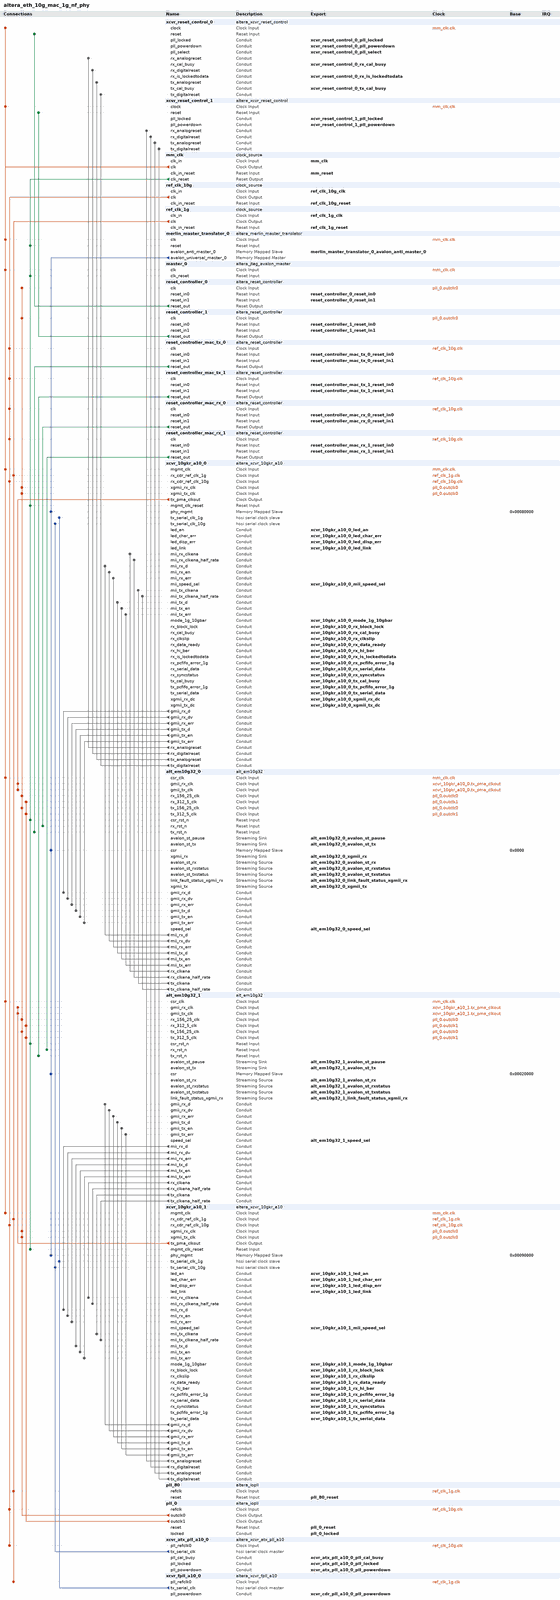
[diagram p0: system contents, whole]
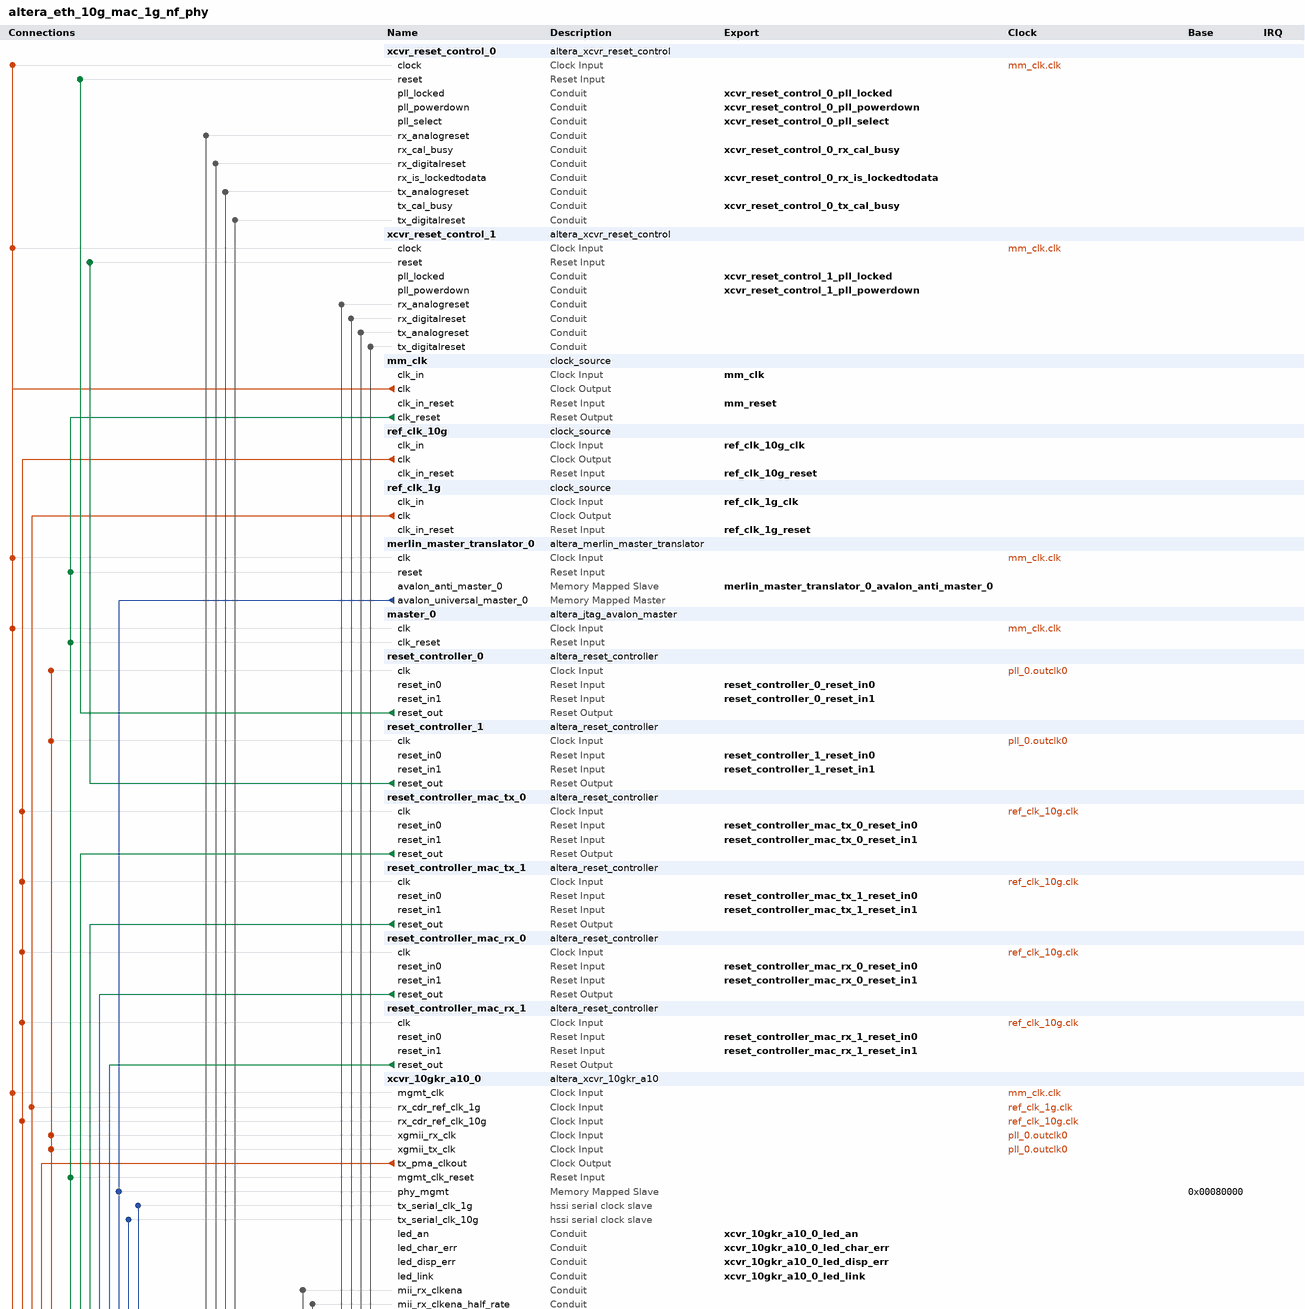
[diagram p1: system contents, upper part]
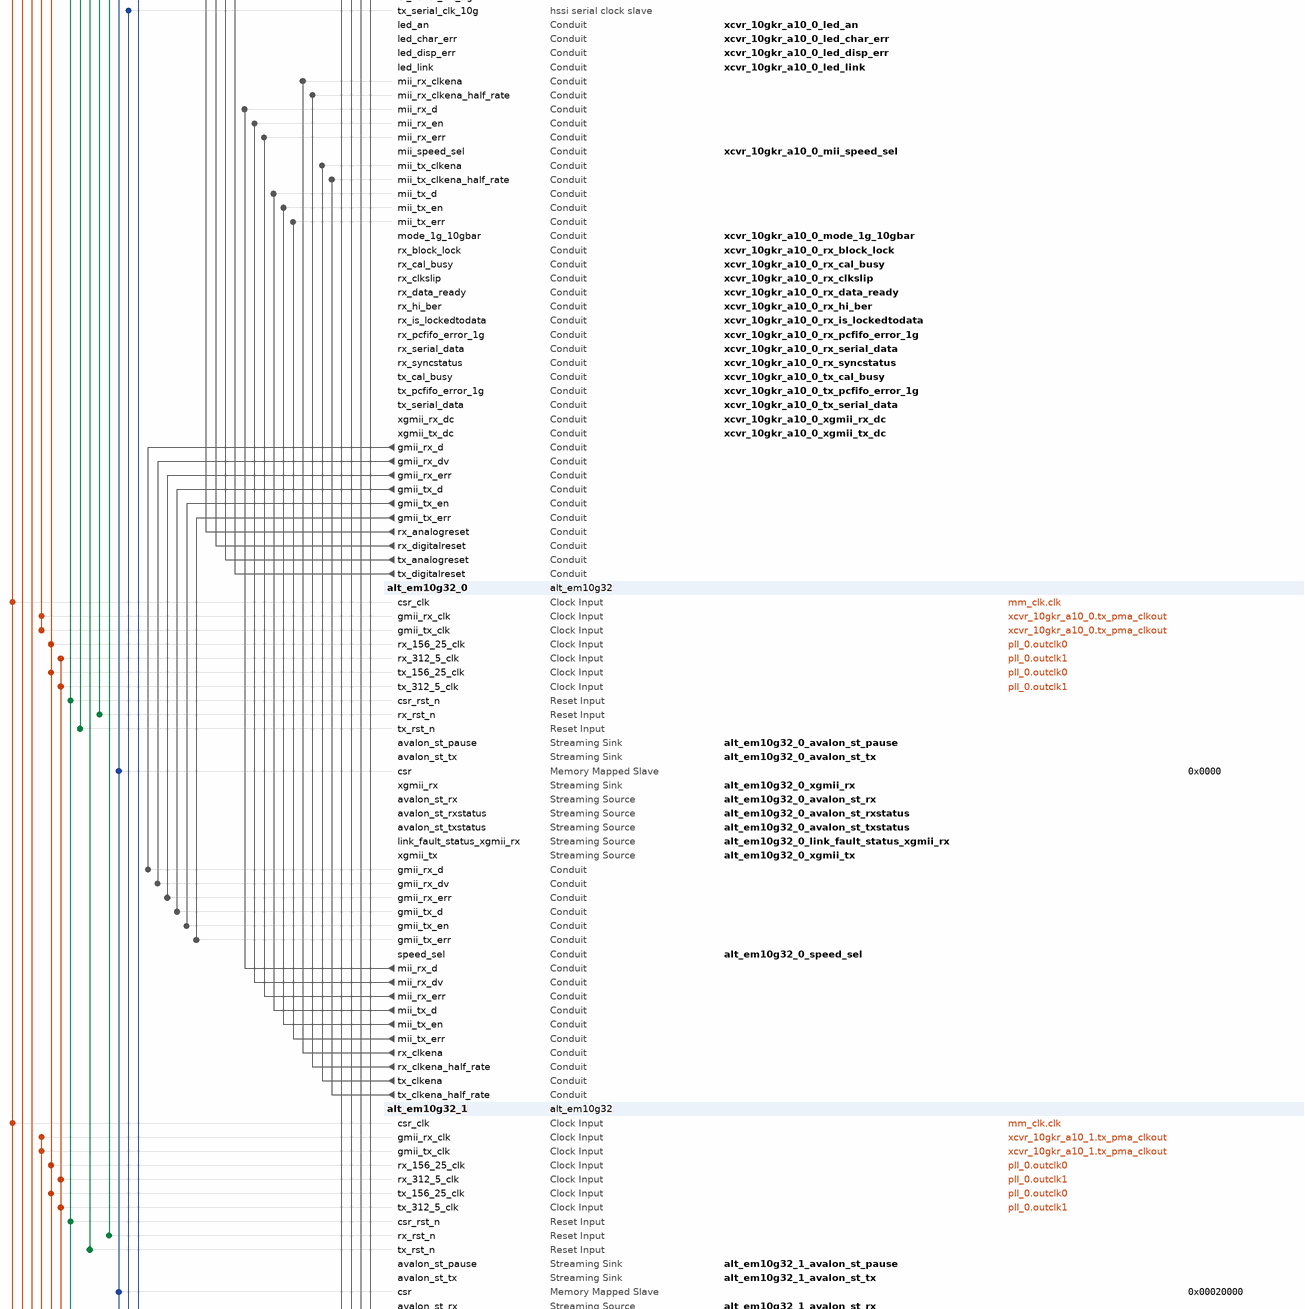
[diagram p2: system contents, middle part]
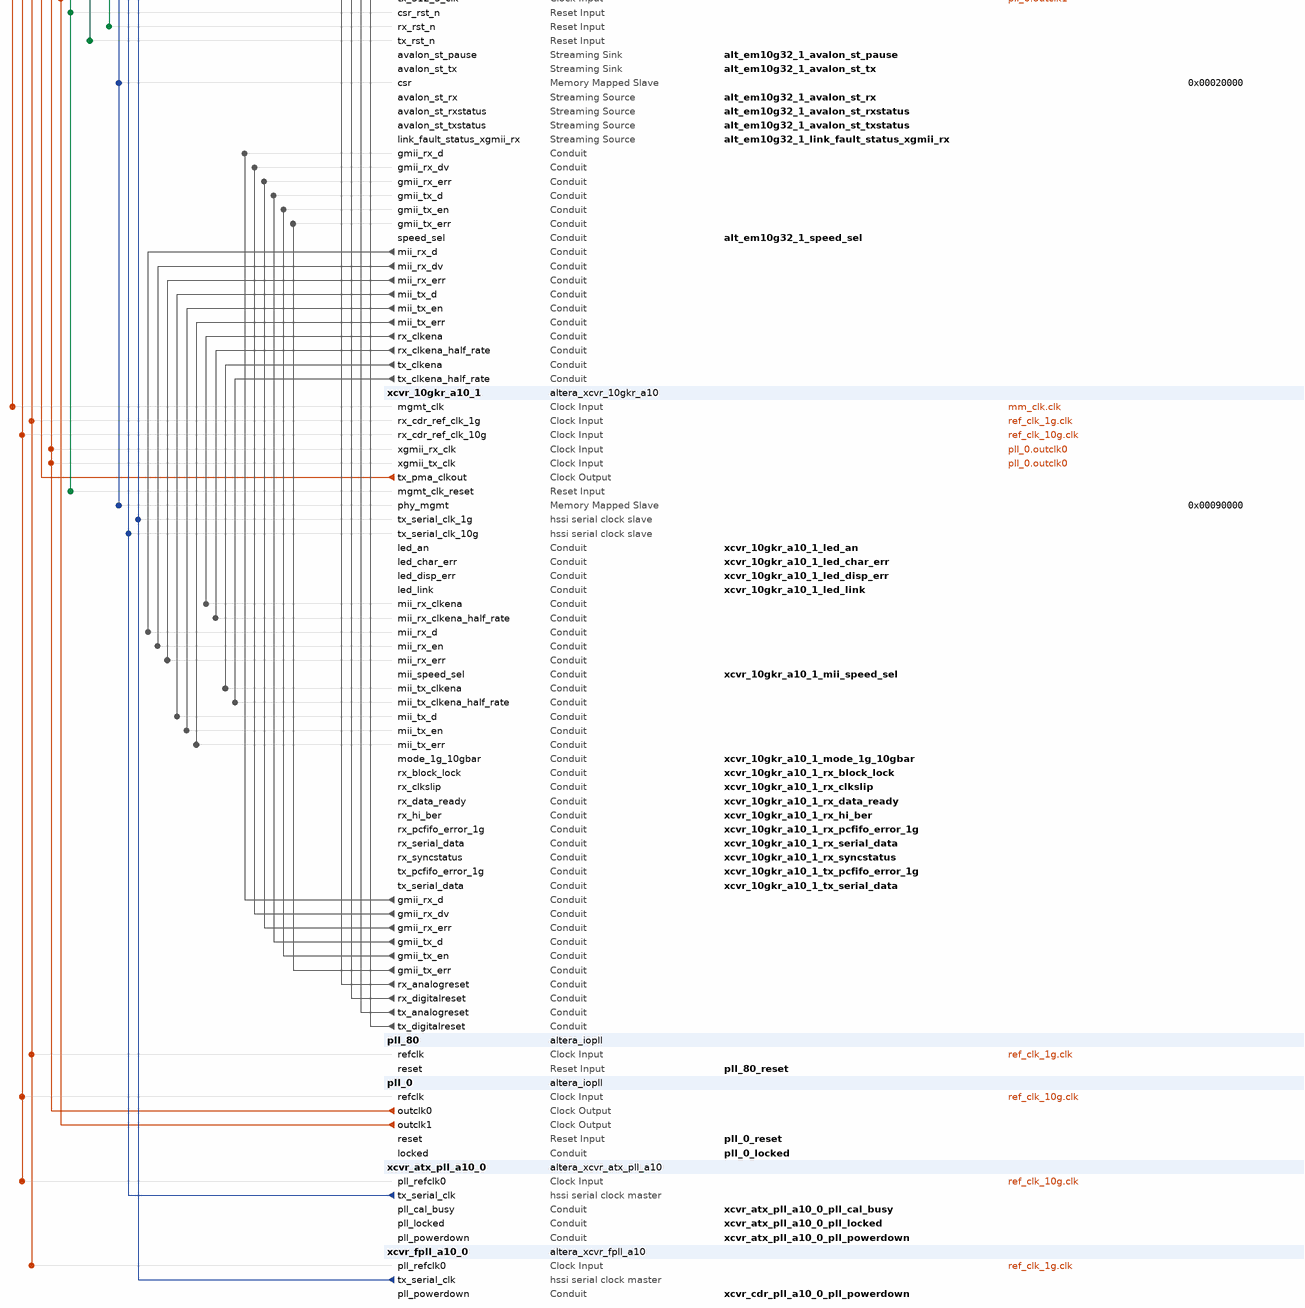
[diagram p3: system contents, lower part]
# Platform Designer (Qsys) system altera_eth_10g_mac_1g_nf_phy, Arria 10 10AX115S4F45I3SG
# Parameters at their usual value, and those the tool derives, are not listed.
package require -exact qsys 1.0
create_system altera_eth_10g_mac_1g_nf_phy
set_project_property DEVICE_FAMILY {Arria 10}
set_project_property DEVICE 10AX115S4F45I3SG

add_component xcvr_reset_control_0 ip/altera_eth_10g_mac_1g_nf_phy/altera_eth_10g_mac_1g_nf_phy_xcvr_reset_control_0.ip altera_xcvr_reset_control xcvr_reset_control_0 18.0

add_component xcvr_reset_control_1 ip/altera_eth_10g_mac_1g_nf_phy/altera_eth_10g_mac_1g_nf_phy_xcvr_reset_control_1.ip altera_xcvr_reset_control xcvr_reset_control_1 18.0

add_component mm_clk ip/altera_eth_10g_mac_1g_nf_phy/altera_eth_10g_mac_1g_nf_phy_mm_clk.ip clock_source mm_clk 

add_component ref_clk_10g ip/altera_eth_10g_mac_1g_nf_phy/altera_eth_10g_mac_1g_nf_phy_ref_clk_10g.ip clock_source ref_clk_10g 

add_component ref_clk_1g ip/altera_eth_10g_mac_1g_nf_phy/altera_eth_10g_mac_1g_nf_phy_ref_clk_1g.ip clock_source ref_clk_1g 

add_component merlin_master_translator_0 ip/altera_eth_10g_mac_1g_nf_phy/altera_eth_10g_mac_1g_nf_phy_merlin_master_translator_0.ip altera_merlin_master_translator merlin_master_translator_0 18.0

add_component master_0 ip/altera_eth_10g_mac_1g_nf_phy/altera_eth_10g_mac_1g_nf_phy_master_0.ip altera_jtag_avalon_master master_0 18.0

add_component reset_controller_0 ip/altera_eth_10g_mac_1g_nf_phy/altera_eth_10g_mac_1g_nf_phy_reset_controller_0.ip altera_reset_controller reset_controller_0 18.0

add_component reset_controller_1 ip/altera_eth_10g_mac_1g_nf_phy/altera_eth_10g_mac_1g_nf_phy_reset_controller_1.ip altera_reset_controller reset_controller_1 18.0

add_component reset_controller_mac_tx_0 ip/altera_eth_10g_mac_1g_nf_phy/altera_eth_10g_mac_1g_nf_phy_reset_controller_mac_tx_0.ip altera_reset_controller reset_controller_mac_tx_0 18.0

add_component reset_controller_mac_tx_1 ip/altera_eth_10g_mac_1g_nf_phy/altera_eth_10g_mac_1g_nf_phy_reset_controller_mac_tx_1.ip altera_reset_controller reset_controller_mac_tx_1 18.0

add_component reset_controller_mac_rx_0 ip/altera_eth_10g_mac_1g_nf_phy/altera_eth_10g_mac_1g_nf_phy_reset_controller_mac_rx_0.ip altera_reset_controller reset_controller_mac_rx_0 18.0

add_component reset_controller_mac_rx_1 ip/altera_eth_10g_mac_1g_nf_phy/altera_eth_10g_mac_1g_nf_phy_reset_controller_mac_rx_1.ip altera_reset_controller reset_controller_mac_rx_1 18.0

add_component xcvr_10gkr_a10_0 ip/altera_eth_10g_mac_1g_nf_phy/altera_eth_10g_mac_1g_nf_phy_xcvr_10gkr_a10_0.ip altera_xcvr_10gkr_a10 xcvr_10gkr_a10_0 18.0

add_component alt_em10g32_0 ip/altera_eth_10g_mac_1g_nf_phy/altera_eth_10g_mac_1g_nf_phy_alt_em10g32_0.ip alt_em10g32 alt_em10g32_0 18.0

add_component alt_em10g32_1 ip/altera_eth_10g_mac_1g_nf_phy/altera_eth_10g_mac_1g_nf_phy_alt_em10g32_1.ip alt_em10g32 alt_em10g32_1 18.0

add_component xcvr_10gkr_a10_1 ip/altera_eth_10g_mac_1g_nf_phy/altera_eth_10g_mac_1g_nf_phy_xcvr_10gkr_a10_1.ip altera_xcvr_10gkr_a10 xcvr_10gkr_a10_1 18.0

add_component pll_80 ip/altera_eth_10g_mac_1g_nf_phy/altera_eth_10g_mac_1g_nf_phy_pll_80.ip altera_iopll pll_80 18.0

add_component pll_0 ip/altera_eth_10g_mac_1g_nf_phy/altera_eth_10g_mac_1g_nf_phy_pll_0.ip altera_iopll pll_0 18.0

add_component xcvr_atx_pll_a10_0 ip/altera_eth_10g_mac_1g_nf_phy/altera_eth_10g_mac_1g_nf_phy_xcvr_atx_pll_a10_0.ip altera_xcvr_atx_pll_a10 xcvr_atx_pll_a10_0 18.0

add_component xcvr_fpll_a10_0 ip/altera_eth_10g_mac_1g_nf_phy/altera_eth_10g_mac_1g_nf_phy_xcvr_fpll_a10_0.ip altera_xcvr_fpll_a10 xcvr_fpll_a10_0 18.0

# connections
add_connection mm_clk.clk alt_em10g32_0.csr_clk clock
add_connection mm_clk.clk alt_em10g32_1.csr_clk clock
add_connection mm_clk.clk master_0.clk clock
add_connection mm_clk.clk merlin_master_translator_0.clk clock
add_connection mm_clk.clk xcvr_10gkr_a10_0.mgmt_clk clock
add_connection mm_clk.clk xcvr_10gkr_a10_1.mgmt_clk clock
add_connection mm_clk.clk xcvr_reset_control_0.clock clock
add_connection mm_clk.clk xcvr_reset_control_1.clock clock
add_connection pll_0.outclk0 alt_em10g32_0.rx_156_25_clk clock
add_connection pll_0.outclk0 alt_em10g32_0.tx_156_25_clk clock
add_connection pll_0.outclk0 alt_em10g32_1.rx_156_25_clk clock
add_connection pll_0.outclk0 alt_em10g32_1.tx_156_25_clk clock
add_connection pll_0.outclk0 reset_controller_0.clk clock
add_connection pll_0.outclk0 reset_controller_1.clk clock
add_connection pll_0.outclk0 xcvr_10gkr_a10_0.xgmii_rx_clk clock
add_connection pll_0.outclk0 xcvr_10gkr_a10_0.xgmii_tx_clk clock
add_connection pll_0.outclk0 xcvr_10gkr_a10_1.xgmii_rx_clk clock
add_connection pll_0.outclk0 xcvr_10gkr_a10_1.xgmii_tx_clk clock
add_connection pll_0.outclk1 alt_em10g32_0.rx_312_5_clk clock
add_connection pll_0.outclk1 alt_em10g32_0.tx_312_5_clk clock
add_connection pll_0.outclk1 alt_em10g32_1.rx_312_5_clk clock
add_connection pll_0.outclk1 alt_em10g32_1.tx_312_5_clk clock
add_connection ref_clk_1g.clk pll_80.refclk clock
add_connection ref_clk_1g.clk xcvr_10gkr_a10_0.rx_cdr_ref_clk_1g clock
add_connection ref_clk_1g.clk xcvr_10gkr_a10_1.rx_cdr_ref_clk_1g clock
add_connection ref_clk_1g.clk xcvr_fpll_a10_0.pll_refclk0 clock
add_connection ref_clk_10g.clk pll_0.refclk clock
add_connection ref_clk_10g.clk reset_controller_mac_rx_0.clk clock
add_connection ref_clk_10g.clk reset_controller_mac_rx_1.clk clock
add_connection ref_clk_10g.clk reset_controller_mac_tx_0.clk clock
add_connection ref_clk_10g.clk reset_controller_mac_tx_1.clk clock
add_connection ref_clk_10g.clk xcvr_10gkr_a10_0.rx_cdr_ref_clk_10g clock
add_connection ref_clk_10g.clk xcvr_10gkr_a10_1.rx_cdr_ref_clk_10g clock
add_connection ref_clk_10g.clk xcvr_atx_pll_a10_0.pll_refclk0 clock
add_connection xcvr_10gkr_a10_0.tx_pma_clkout alt_em10g32_0.gmii_rx_clk clock
add_connection xcvr_10gkr_a10_0.tx_pma_clkout alt_em10g32_0.gmii_tx_clk clock
add_connection xcvr_10gkr_a10_1.tx_pma_clkout alt_em10g32_1.gmii_rx_clk clock
add_connection xcvr_10gkr_a10_1.tx_pma_clkout alt_em10g32_1.gmii_tx_clk clock
add_connection mm_clk.clk_reset alt_em10g32_0.csr_rst_n reset
add_connection mm_clk.clk_reset alt_em10g32_1.csr_rst_n reset
add_connection mm_clk.clk_reset master_0.clk_reset reset
add_connection mm_clk.clk_reset merlin_master_translator_0.reset reset
add_connection mm_clk.clk_reset xcvr_10gkr_a10_0.mgmt_clk_reset reset
add_connection mm_clk.clk_reset xcvr_10gkr_a10_1.mgmt_clk_reset reset
add_connection reset_controller_0.reset_out xcvr_reset_control_0.reset reset
add_connection reset_controller_1.reset_out xcvr_reset_control_1.reset reset
add_connection reset_controller_mac_rx_0.reset_out alt_em10g32_0.rx_rst_n reset
add_connection reset_controller_mac_rx_1.reset_out alt_em10g32_1.rx_rst_n reset
add_connection reset_controller_mac_tx_0.reset_out alt_em10g32_0.tx_rst_n reset
add_connection reset_controller_mac_tx_1.reset_out alt_em10g32_1.tx_rst_n reset
add_connection merlin_master_translator_0.avalon_universal_master_0 alt_em10g32_0.csr avalon
set_connection_parameter_value merlin_master_translator_0.avalon_universal_master_0/alt_em10g32_0.csr baseAddress 0x0000
add_connection merlin_master_translator_0.avalon_universal_master_0 alt_em10g32_1.csr avalon
set_connection_parameter_value merlin_master_translator_0.avalon_universal_master_0/alt_em10g32_1.csr baseAddress 0x00020000
add_connection merlin_master_translator_0.avalon_universal_master_0 xcvr_10gkr_a10_0.phy_mgmt avalon
set_connection_parameter_value merlin_master_translator_0.avalon_universal_master_0/xcvr_10gkr_a10_0.phy_mgmt baseAddress 0x00080000
add_connection merlin_master_translator_0.avalon_universal_master_0 xcvr_10gkr_a10_1.phy_mgmt avalon
set_connection_parameter_value merlin_master_translator_0.avalon_universal_master_0/xcvr_10gkr_a10_1.phy_mgmt baseAddress 0x00090000
add_connection alt_em10g32_0.mii_rx_d xcvr_10gkr_a10_0.mii_rx_d conduit
add_connection alt_em10g32_0.mii_rx_dv xcvr_10gkr_a10_0.mii_rx_en conduit
add_connection alt_em10g32_0.mii_rx_err xcvr_10gkr_a10_0.mii_rx_err conduit
add_connection alt_em10g32_0.mii_tx_d xcvr_10gkr_a10_0.mii_tx_d conduit
add_connection alt_em10g32_0.mii_tx_en xcvr_10gkr_a10_0.mii_tx_en conduit
add_connection alt_em10g32_0.mii_tx_err xcvr_10gkr_a10_0.mii_tx_err conduit
add_connection alt_em10g32_0.rx_clkena xcvr_10gkr_a10_0.mii_rx_clkena conduit
add_connection alt_em10g32_0.rx_clkena_half_rate xcvr_10gkr_a10_0.mii_rx_clkena_half_rate conduit
add_connection alt_em10g32_0.tx_clkena xcvr_10gkr_a10_0.mii_tx_clkena conduit
add_connection alt_em10g32_0.tx_clkena_half_rate xcvr_10gkr_a10_0.mii_tx_clkena_half_rate conduit
add_connection alt_em10g32_1.mii_rx_d xcvr_10gkr_a10_1.mii_rx_d conduit
add_connection alt_em10g32_1.mii_rx_dv xcvr_10gkr_a10_1.mii_rx_en conduit
add_connection alt_em10g32_1.mii_rx_err xcvr_10gkr_a10_1.mii_rx_err conduit
add_connection alt_em10g32_1.mii_tx_d xcvr_10gkr_a10_1.mii_tx_d conduit
add_connection alt_em10g32_1.mii_tx_en xcvr_10gkr_a10_1.mii_tx_en conduit
add_connection alt_em10g32_1.mii_tx_err xcvr_10gkr_a10_1.mii_tx_err conduit
add_connection alt_em10g32_1.rx_clkena xcvr_10gkr_a10_1.mii_rx_clkena conduit
add_connection alt_em10g32_1.rx_clkena_half_rate xcvr_10gkr_a10_1.mii_rx_clkena_half_rate conduit
add_connection alt_em10g32_1.tx_clkena xcvr_10gkr_a10_1.mii_tx_clkena conduit
add_connection alt_em10g32_1.tx_clkena_half_rate xcvr_10gkr_a10_1.mii_tx_clkena_half_rate conduit
add_connection xcvr_10gkr_a10_0.gmii_rx_d alt_em10g32_0.gmii_rx_d conduit
add_connection xcvr_10gkr_a10_0.gmii_rx_dv alt_em10g32_0.gmii_rx_dv conduit
add_connection xcvr_10gkr_a10_0.gmii_rx_err alt_em10g32_0.gmii_rx_err conduit
add_connection xcvr_10gkr_a10_0.gmii_tx_d alt_em10g32_0.gmii_tx_d conduit
add_connection xcvr_10gkr_a10_0.gmii_tx_en alt_em10g32_0.gmii_tx_en conduit
add_connection xcvr_10gkr_a10_0.gmii_tx_err alt_em10g32_0.gmii_tx_err conduit
add_connection xcvr_10gkr_a10_0.rx_analogreset xcvr_reset_control_0.rx_analogreset conduit
add_connection xcvr_10gkr_a10_0.rx_digitalreset xcvr_reset_control_0.rx_digitalreset conduit
add_connection xcvr_10gkr_a10_0.tx_analogreset xcvr_reset_control_0.tx_analogreset conduit
add_connection xcvr_10gkr_a10_0.tx_digitalreset xcvr_reset_control_0.tx_digitalreset conduit
add_connection xcvr_10gkr_a10_1.gmii_rx_d alt_em10g32_1.gmii_rx_d conduit
add_connection xcvr_10gkr_a10_1.gmii_rx_dv alt_em10g32_1.gmii_rx_dv conduit
add_connection xcvr_10gkr_a10_1.gmii_rx_err alt_em10g32_1.gmii_rx_err conduit
add_connection xcvr_10gkr_a10_1.gmii_tx_d alt_em10g32_1.gmii_tx_d conduit
add_connection xcvr_10gkr_a10_1.gmii_tx_en alt_em10g32_1.gmii_tx_en conduit
add_connection xcvr_10gkr_a10_1.gmii_tx_err alt_em10g32_1.gmii_tx_err conduit
add_connection xcvr_10gkr_a10_1.rx_analogreset xcvr_reset_control_1.rx_analogreset conduit
add_connection xcvr_10gkr_a10_1.rx_digitalreset xcvr_reset_control_1.rx_digitalreset conduit
add_connection xcvr_10gkr_a10_1.tx_analogreset xcvr_reset_control_1.tx_analogreset conduit
add_connection xcvr_10gkr_a10_1.tx_digitalreset xcvr_reset_control_1.tx_digitalreset conduit
add_connection xcvr_atx_pll_a10_0.tx_serial_clk xcvr_10gkr_a10_0.tx_serial_clk_10g hssi_serial_clock
add_connection xcvr_atx_pll_a10_0.tx_serial_clk xcvr_10gkr_a10_1.tx_serial_clk_10g hssi_serial_clock
add_connection xcvr_fpll_a10_0.tx_serial_clk xcvr_10gkr_a10_0.tx_serial_clk_1g hssi_serial_clock
add_connection xcvr_fpll_a10_0.tx_serial_clk xcvr_10gkr_a10_1.tx_serial_clk_1g hssi_serial_clock

# exported interfaces
add_interface alt_em10g32_0_avalon_st_pause avalon_streaming sink
set_interface_property alt_em10g32_0_avalon_st_pause EXPORT_OF alt_em10g32_0.avalon_st_pause
add_interface alt_em10g32_0_avalon_st_rx avalon_streaming source
set_interface_property alt_em10g32_0_avalon_st_rx EXPORT_OF alt_em10g32_0.avalon_st_rx
add_interface alt_em10g32_0_avalon_st_rxstatus avalon_streaming source
set_interface_property alt_em10g32_0_avalon_st_rxstatus EXPORT_OF alt_em10g32_0.avalon_st_rxstatus
add_interface alt_em10g32_0_avalon_st_tx avalon_streaming sink
set_interface_property alt_em10g32_0_avalon_st_tx EXPORT_OF alt_em10g32_0.avalon_st_tx
add_interface alt_em10g32_0_avalon_st_txstatus avalon_streaming source
set_interface_property alt_em10g32_0_avalon_st_txstatus EXPORT_OF alt_em10g32_0.avalon_st_txstatus
add_interface alt_em10g32_0_link_fault_status_xgmii_rx avalon_streaming source
set_interface_property alt_em10g32_0_link_fault_status_xgmii_rx EXPORT_OF alt_em10g32_0.link_fault_status_xgmii_rx
add_interface alt_em10g32_0_speed_sel conduit end
set_interface_property alt_em10g32_0_speed_sel EXPORT_OF alt_em10g32_0.speed_sel
add_interface alt_em10g32_0_xgmii_rx avalon_streaming sink
set_interface_property alt_em10g32_0_xgmii_rx EXPORT_OF alt_em10g32_0.xgmii_rx
add_interface alt_em10g32_0_xgmii_tx avalon_streaming source
set_interface_property alt_em10g32_0_xgmii_tx EXPORT_OF alt_em10g32_0.xgmii_tx
add_interface alt_em10g32_1_avalon_st_pause avalon_streaming sink
set_interface_property alt_em10g32_1_avalon_st_pause EXPORT_OF alt_em10g32_1.avalon_st_pause
add_interface alt_em10g32_1_avalon_st_rx avalon_streaming source
set_interface_property alt_em10g32_1_avalon_st_rx EXPORT_OF alt_em10g32_1.avalon_st_rx
add_interface alt_em10g32_1_avalon_st_rxstatus avalon_streaming source
set_interface_property alt_em10g32_1_avalon_st_rxstatus EXPORT_OF alt_em10g32_1.avalon_st_rxstatus
add_interface alt_em10g32_1_avalon_st_tx avalon_streaming sink
set_interface_property alt_em10g32_1_avalon_st_tx EXPORT_OF alt_em10g32_1.avalon_st_tx
add_interface alt_em10g32_1_avalon_st_txstatus avalon_streaming source
set_interface_property alt_em10g32_1_avalon_st_txstatus EXPORT_OF alt_em10g32_1.avalon_st_txstatus
add_interface alt_em10g32_1_link_fault_status_xgmii_rx avalon_streaming source
set_interface_property alt_em10g32_1_link_fault_status_xgmii_rx EXPORT_OF alt_em10g32_1.link_fault_status_xgmii_rx
add_interface alt_em10g32_1_speed_sel conduit end
set_interface_property alt_em10g32_1_speed_sel EXPORT_OF alt_em10g32_1.speed_sel
add_interface merlin_master_translator_0_avalon_anti_master_0 avalon slave
set_interface_property merlin_master_translator_0_avalon_anti_master_0 EXPORT_OF merlin_master_translator_0.avalon_anti_master_0
add_interface mm_clk clock sink
set_interface_property mm_clk EXPORT_OF mm_clk.clk_in
add_interface mm_reset reset sink
set_interface_property mm_reset EXPORT_OF mm_clk.clk_in_reset
add_interface pll_0_locked conduit end
set_interface_property pll_0_locked EXPORT_OF pll_0.locked
add_interface pll_0_reset reset sink
set_interface_property pll_0_reset EXPORT_OF pll_0.reset
add_interface pll_80_reset reset sink
set_interface_property pll_80_reset EXPORT_OF pll_80.reset
add_interface ref_clk_10g_clk clock sink
set_interface_property ref_clk_10g_clk EXPORT_OF ref_clk_10g.clk_in
add_interface ref_clk_10g_reset reset sink
set_interface_property ref_clk_10g_reset EXPORT_OF ref_clk_10g.clk_in_reset
add_interface ref_clk_1g_clk clock sink
set_interface_property ref_clk_1g_clk EXPORT_OF ref_clk_1g.clk_in
add_interface ref_clk_1g_reset reset sink
set_interface_property ref_clk_1g_reset EXPORT_OF ref_clk_1g.clk_in_reset
add_interface reset_controller_0_reset_in0 reset sink
set_interface_property reset_controller_0_reset_in0 EXPORT_OF reset_controller_0.reset_in0
add_interface reset_controller_0_reset_in1 reset sink
set_interface_property reset_controller_0_reset_in1 EXPORT_OF reset_controller_0.reset_in1
add_interface reset_controller_1_reset_in0 reset sink
set_interface_property reset_controller_1_reset_in0 EXPORT_OF reset_controller_1.reset_in0
add_interface reset_controller_1_reset_in1 reset sink
set_interface_property reset_controller_1_reset_in1 EXPORT_OF reset_controller_1.reset_in1
add_interface reset_controller_mac_rx_0_reset_in0 reset sink
set_interface_property reset_controller_mac_rx_0_reset_in0 EXPORT_OF reset_controller_mac_rx_0.reset_in0
add_interface reset_controller_mac_rx_0_reset_in1 reset sink
set_interface_property reset_controller_mac_rx_0_reset_in1 EXPORT_OF reset_controller_mac_rx_0.reset_in1
add_interface reset_controller_mac_rx_1_reset_in0 reset sink
set_interface_property reset_controller_mac_rx_1_reset_in0 EXPORT_OF reset_controller_mac_rx_1.reset_in0
add_interface reset_controller_mac_rx_1_reset_in1 reset sink
set_interface_property reset_controller_mac_rx_1_reset_in1 EXPORT_OF reset_controller_mac_rx_1.reset_in1
add_interface reset_controller_mac_tx_0_reset_in0 reset sink
set_interface_property reset_controller_mac_tx_0_reset_in0 EXPORT_OF reset_controller_mac_tx_0.reset_in0
add_interface reset_controller_mac_tx_0_reset_in1 reset sink
set_interface_property reset_controller_mac_tx_0_reset_in1 EXPORT_OF reset_controller_mac_tx_0.reset_in1
add_interface reset_controller_mac_tx_1_reset_in0 reset sink
set_interface_property reset_controller_mac_tx_1_reset_in0 EXPORT_OF reset_controller_mac_tx_1.reset_in0
add_interface reset_controller_mac_tx_1_reset_in1 reset sink
set_interface_property reset_controller_mac_tx_1_reset_in1 EXPORT_OF reset_controller_mac_tx_1.reset_in1
add_interface xcvr_10gkr_a10_0_led_an conduit end
set_interface_property xcvr_10gkr_a10_0_led_an EXPORT_OF xcvr_10gkr_a10_0.led_an
add_interface xcvr_10gkr_a10_0_led_char_err conduit end
set_interface_property xcvr_10gkr_a10_0_led_char_err EXPORT_OF xcvr_10gkr_a10_0.led_char_err
add_interface xcvr_10gkr_a10_0_led_disp_err conduit end
set_interface_property xcvr_10gkr_a10_0_led_disp_err EXPORT_OF xcvr_10gkr_a10_0.led_disp_err
add_interface xcvr_10gkr_a10_0_led_link conduit end
set_interface_property xcvr_10gkr_a10_0_led_link EXPORT_OF xcvr_10gkr_a10_0.led_link
add_interface xcvr_10gkr_a10_0_mii_speed_sel conduit end
set_interface_property xcvr_10gkr_a10_0_mii_speed_sel EXPORT_OF xcvr_10gkr_a10_0.mii_speed_sel
add_interface xcvr_10gkr_a10_0_mode_1g_10gbar conduit end
set_interface_property xcvr_10gkr_a10_0_mode_1g_10gbar EXPORT_OF xcvr_10gkr_a10_0.mode_1g_10gbar
add_interface xcvr_10gkr_a10_0_rx_block_lock conduit end
set_interface_property xcvr_10gkr_a10_0_rx_block_lock EXPORT_OF xcvr_10gkr_a10_0.rx_block_lock
add_interface xcvr_10gkr_a10_0_rx_cal_busy conduit end
set_interface_property xcvr_10gkr_a10_0_rx_cal_busy EXPORT_OF xcvr_10gkr_a10_0.rx_cal_busy
add_interface xcvr_10gkr_a10_0_rx_clkslip conduit end
set_interface_property xcvr_10gkr_a10_0_rx_clkslip EXPORT_OF xcvr_10gkr_a10_0.rx_clkslip
add_interface xcvr_10gkr_a10_0_rx_data_ready conduit end
set_interface_property xcvr_10gkr_a10_0_rx_data_ready EXPORT_OF xcvr_10gkr_a10_0.rx_data_ready
add_interface xcvr_10gkr_a10_0_rx_hi_ber conduit end
set_interface_property xcvr_10gkr_a10_0_rx_hi_ber EXPORT_OF xcvr_10gkr_a10_0.rx_hi_ber
add_interface xcvr_10gkr_a10_0_rx_is_lockedtodata conduit end
set_interface_property xcvr_10gkr_a10_0_rx_is_lockedtodata EXPORT_OF xcvr_10gkr_a10_0.rx_is_lockedtodata
add_interface xcvr_10gkr_a10_0_rx_pcfifo_error_1g conduit end
set_interface_property xcvr_10gkr_a10_0_rx_pcfifo_error_1g EXPORT_OF xcvr_10gkr_a10_0.rx_pcfifo_error_1g
add_interface xcvr_10gkr_a10_0_rx_serial_data conduit end
set_interface_property xcvr_10gkr_a10_0_rx_serial_data EXPORT_OF xcvr_10gkr_a10_0.rx_serial_data
add_interface xcvr_10gkr_a10_0_rx_syncstatus conduit end
set_interface_property xcvr_10gkr_a10_0_rx_syncstatus EXPORT_OF xcvr_10gkr_a10_0.rx_syncstatus
add_interface xcvr_10gkr_a10_0_tx_cal_busy conduit end
set_interface_property xcvr_10gkr_a10_0_tx_cal_busy EXPORT_OF xcvr_10gkr_a10_0.tx_cal_busy
add_interface xcvr_10gkr_a10_0_tx_pcfifo_error_1g conduit end
set_interface_property xcvr_10gkr_a10_0_tx_pcfifo_error_1g EXPORT_OF xcvr_10gkr_a10_0.tx_pcfifo_error_1g
add_interface xcvr_10gkr_a10_0_tx_serial_data conduit end
set_interface_property xcvr_10gkr_a10_0_tx_serial_data EXPORT_OF xcvr_10gkr_a10_0.tx_serial_data
add_interface xcvr_10gkr_a10_0_xgmii_rx_dc conduit end
set_interface_property xcvr_10gkr_a10_0_xgmii_rx_dc EXPORT_OF xcvr_10gkr_a10_0.xgmii_rx_dc
add_interface xcvr_10gkr_a10_0_xgmii_tx_dc conduit end
set_interface_property xcvr_10gkr_a10_0_xgmii_tx_dc EXPORT_OF xcvr_10gkr_a10_0.xgmii_tx_dc
add_interface xcvr_10gkr_a10_1_led_an conduit end
set_interface_property xcvr_10gkr_a10_1_led_an EXPORT_OF xcvr_10gkr_a10_1.led_an
add_interface xcvr_10gkr_a10_1_led_char_err conduit end
set_interface_property xcvr_10gkr_a10_1_led_char_err EXPORT_OF xcvr_10gkr_a10_1.led_char_err
add_interface xcvr_10gkr_a10_1_led_disp_err conduit end
set_interface_property xcvr_10gkr_a10_1_led_disp_err EXPORT_OF xcvr_10gkr_a10_1.led_disp_err
add_interface xcvr_10gkr_a10_1_led_link conduit end
set_interface_property xcvr_10gkr_a10_1_led_link EXPORT_OF xcvr_10gkr_a10_1.led_link
add_interface xcvr_10gkr_a10_1_mii_speed_sel conduit end
set_interface_property xcvr_10gkr_a10_1_mii_speed_sel EXPORT_OF xcvr_10gkr_a10_1.mii_speed_sel
add_interface xcvr_10gkr_a10_1_mode_1g_10gbar conduit end
set_interface_property xcvr_10gkr_a10_1_mode_1g_10gbar EXPORT_OF xcvr_10gkr_a10_1.mode_1g_10gbar
add_interface xcvr_10gkr_a10_1_rx_block_lock conduit end
set_interface_property xcvr_10gkr_a10_1_rx_block_lock EXPORT_OF xcvr_10gkr_a10_1.rx_block_lock
add_interface xcvr_10gkr_a10_1_rx_clkslip conduit end
set_interface_property xcvr_10gkr_a10_1_rx_clkslip EXPORT_OF xcvr_10gkr_a10_1.rx_clkslip
add_interface xcvr_10gkr_a10_1_rx_data_ready conduit end
set_interface_property xcvr_10gkr_a10_1_rx_data_ready EXPORT_OF xcvr_10gkr_a10_1.rx_data_ready
add_interface xcvr_10gkr_a10_1_rx_hi_ber conduit end
set_interface_property xcvr_10gkr_a10_1_rx_hi_ber EXPORT_OF xcvr_10gkr_a10_1.rx_hi_ber
add_interface xcvr_10gkr_a10_1_rx_pcfifo_error_1g conduit end
set_interface_property xcvr_10gkr_a10_1_rx_pcfifo_error_1g EXPORT_OF xcvr_10gkr_a10_1.rx_pcfifo_error_1g
add_interface xcvr_10gkr_a10_1_rx_serial_data conduit end
set_interface_property xcvr_10gkr_a10_1_rx_serial_data EXPORT_OF xcvr_10gkr_a10_1.rx_serial_data
add_interface xcvr_10gkr_a10_1_rx_syncstatus conduit end
set_interface_property xcvr_10gkr_a10_1_rx_syncstatus EXPORT_OF xcvr_10gkr_a10_1.rx_syncstatus
add_interface xcvr_10gkr_a10_1_tx_pcfifo_error_1g conduit end
set_interface_property xcvr_10gkr_a10_1_tx_pcfifo_error_1g EXPORT_OF xcvr_10gkr_a10_1.tx_pcfifo_error_1g
add_interface xcvr_10gkr_a10_1_tx_serial_data conduit end
set_interface_property xcvr_10gkr_a10_1_tx_serial_data EXPORT_OF xcvr_10gkr_a10_1.tx_serial_data
add_interface xcvr_atx_pll_a10_0_pll_cal_busy conduit end
set_interface_property xcvr_atx_pll_a10_0_pll_cal_busy EXPORT_OF xcvr_atx_pll_a10_0.pll_cal_busy
add_interface xcvr_atx_pll_a10_0_pll_locked conduit end
set_interface_property xcvr_atx_pll_a10_0_pll_locked EXPORT_OF xcvr_atx_pll_a10_0.pll_locked
add_interface xcvr_atx_pll_a10_0_pll_powerdown conduit end
set_interface_property xcvr_atx_pll_a10_0_pll_powerdown EXPORT_OF xcvr_atx_pll_a10_0.pll_powerdown
add_interface xcvr_cdr_pll_a10_0_pll_powerdown conduit end
set_interface_property xcvr_cdr_pll_a10_0_pll_powerdown EXPORT_OF xcvr_fpll_a10_0.pll_powerdown
add_interface xcvr_reset_control_0_pll_locked conduit end
set_interface_property xcvr_reset_control_0_pll_locked EXPORT_OF xcvr_reset_control_0.pll_locked
add_interface xcvr_reset_control_0_pll_powerdown conduit end
set_interface_property xcvr_reset_control_0_pll_powerdown EXPORT_OF xcvr_reset_control_0.pll_powerdown
add_interface xcvr_reset_control_0_pll_select conduit end
set_interface_property xcvr_reset_control_0_pll_select EXPORT_OF xcvr_reset_control_0.pll_select
add_interface xcvr_reset_control_0_rx_cal_busy conduit end
set_interface_property xcvr_reset_control_0_rx_cal_busy EXPORT_OF xcvr_reset_control_0.rx_cal_busy
add_interface xcvr_reset_control_0_rx_is_lockedtodata conduit end
set_interface_property xcvr_reset_control_0_rx_is_lockedtodata EXPORT_OF xcvr_reset_control_0.rx_is_lockedtodata
add_interface xcvr_reset_control_0_tx_cal_busy conduit end
set_interface_property xcvr_reset_control_0_tx_cal_busy EXPORT_OF xcvr_reset_control_0.tx_cal_busy
add_interface xcvr_reset_control_1_pll_locked conduit end
set_interface_property xcvr_reset_control_1_pll_locked EXPORT_OF xcvr_reset_control_1.pll_locked
add_interface xcvr_reset_control_1_pll_powerdown conduit end
set_interface_property xcvr_reset_control_1_pll_powerdown EXPORT_OF xcvr_reset_control_1.pll_powerdown

set_interconnect_requirement {$system} qsys_mm.clockCrossingAdapter HANDSHAKE
set_interconnect_requirement {$system} qsys_mm.maxAdditionalLatency 1

save_system altera_eth_10g_mac_1g_nf_phy.qsys
